# EAGLE design mcuBoard (EAGLE 7.4.0)
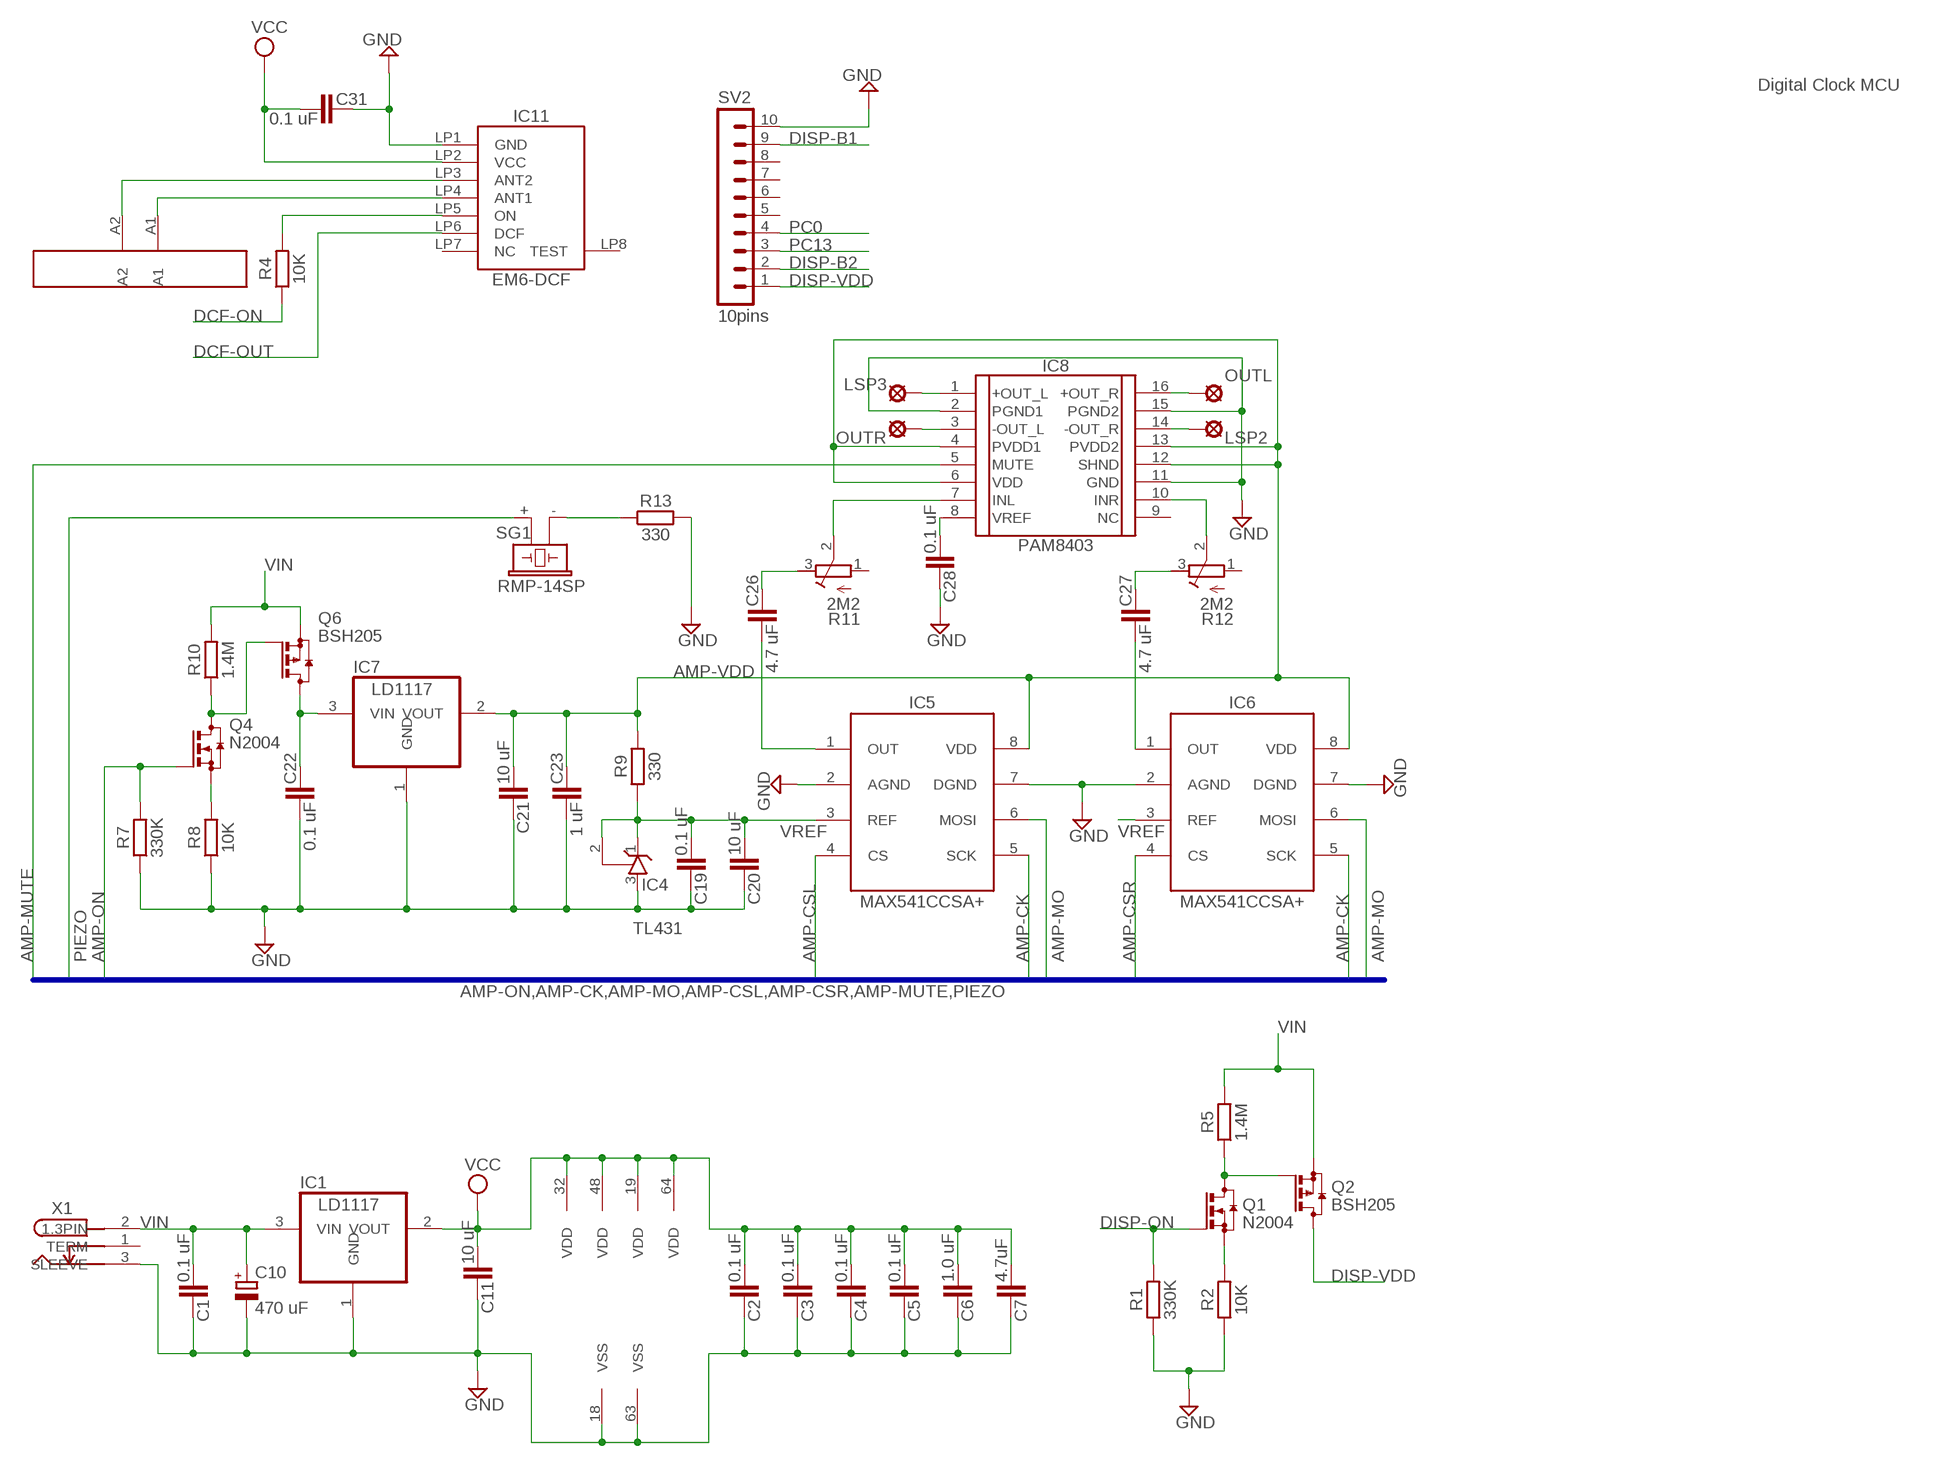
[diagram p0: schematic, sheet 1, part 1 of 2]
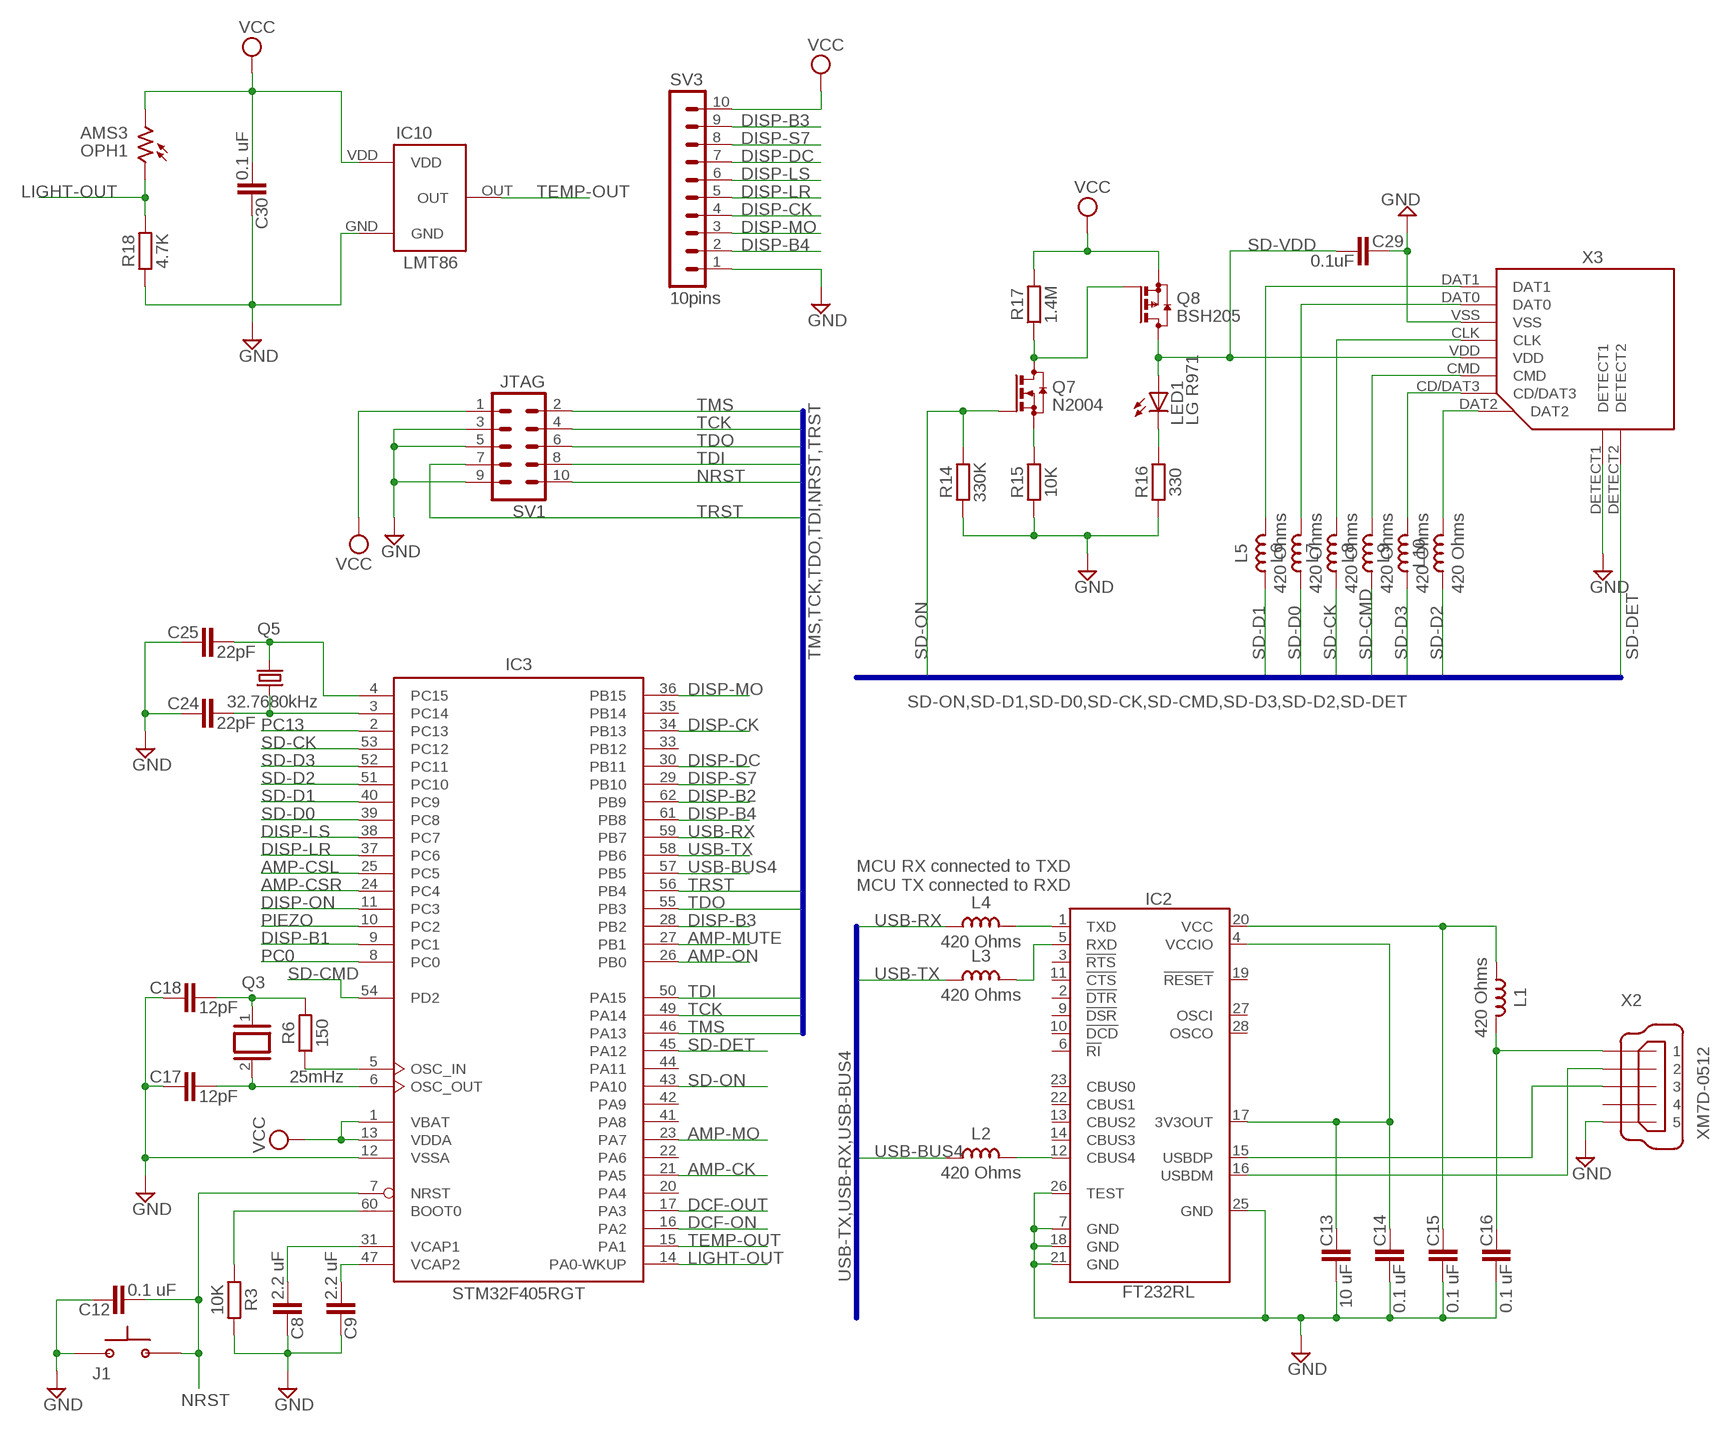
[diagram p1: schematic, sheet 1, part 2 of 2]

## Parts
A1  DCF77-ANT  [DCF77-ANT]
C1  0.1 uF  C-EUC1206  [C1206]
C2  0.1 uF  C-EUC1206  [C1206]
C3  0.1 uF  C-EUC1206  [C1206]
C4  0.1 uF  C-EUC1206  [C1206]
C5  0.1 uF  C-EUC1206  [C1206]
C6  1.0 uF  C-EUC1206  [C1206]
C7  4.7uF  C-EUC1206  [C1206]
C8  2.2 uF  C-EUC1206  [C1206]
C9  2.2 uF  C-EUC1206  [C1206]
C10  470 uF  CPOL-EUTT5D11L  [TT5D11L]
C11  10 uF  C-EUC1206  [C1206]
C12  0.1 uF  C-EUC1206  [C1206]
C13  10 uF  C-EUC1206  [C1206]
C14  0.1 uF  C-EUC1206  [C1206]
C15  0.1 uF  C-EUC1206  [C1206]
C16  0.1 uF  C-EUC1206  [C1206]
C17  12pF  C-EUC1206  [C1206]
C18  12pF  C-EUC1206  [C1206]
C19  0.1 uF  C-EUC1206  [C1206]
C20  10 uF  C-EUC1206  [C1206]
C21  10 uF  C-EUC1206  [C1206]
C22  0.1 uF  C-EUC1206  [C1206]
C23  1 uF  C-EUC1206  [C1206]
C24  22pF  C-EUC1206  [C1206]
C25  22pF  C-EUC1206  [C1206]
C26  4.7 uF  C-EUC1206  [C1206]
C27  4.7 uF  C-EUC1206  [C1206]
C28  0.1 uF  C-EUC1206  [C1206]
C29  0.1uF  C-EUC1206  [C1206]
C30  0.1 uF  C-EUC1206  [C1206]
C31  0.1 uF  C-EUC1206  [C1206]
IC1  LD1117  REG1117  [SOT223]
IC2  FT232RL  [SSOP28]
IC3  STM32F405RGT  [LQFP64]
IC4  TL431  TL431CL3T  [SOT-23]
IC5  MAX541CCSA+  MAX541  [SOIC-8]
IC6  MAX541CCSA+  MAX541  [SOIC-8]
IC7  LD1117  REG1117  [SOT223]
IC8  PAM8403  [SOP-16]
IC10  LMT86  [LMT86]
IC11  DCF77  [DCF77]
J1  BUTTON-FSM14JRT  [BUTTON-FSM14JRT]
L1  420 Ohms  L0603  [L0603]
L2  420 Ohms  L0603  [L0603]
L3  420 Ohms  L0603  [L0603]
L4  420 Ohms  L0603  [L0603]
L5  420 Ohms  L0603  [L0603]
L6  420 Ohms  L0603  [L0603]
L7  420 Ohms  L0603  [L0603]
L8  420 Ohms  L0603  [L0603]
L9  420 Ohms  L0603  [L0603]
L10  420 Ohms  L0603  [L0603]
LED1  LG R971  LEDCHIP-LED0805  [CHIP-LED0805]
LSP2  LSP10  [LSP10]
LSP3  LSP10  [LSP10]
OPH1  AMS3  VT935GB  [VT900]
OUTL  LSP10  [LSP10]
OUTR  LSP10  [LSP10]
Q1  N2004  BSS123  [SOT23]
Q2  BSH205  BSS84  [SOT23]
Q3  25mHz  HC-46X  [HC-46X]
Q4  N2004  BSS123  [SOT23]
Q5  32.7680kHz  MC-306  [MC-306]
Q6  BSH205  BSS84  [SOT23]
Q7  N2004  BSS123  [SOT23]
Q8  BSH205  BSS84  [SOT23]
R1  330K  R-EU_R1206  [R1206]
R2  10K  R-EU_R1206  [R1206]
R3  10K  R-EU_R1206  [R1206]
R4  10K  R-EU_R1206  [R1206]
R5  1.4M  R-EU_R1206  [R1206]
R6  150  R-EU_R1206  [R1206]
R7  330K  R-EU_R1206  [R1206]
R8  10K  R-EU_R1206  [R1206]
R9  330  R-EU_R1206  [R1206]
R10  1.4M  R-EU_R1206  [R1206]
R11  2M2  R-TRIM3362U  [R-TRIM-3362U]
R12  2M2  R-TRIM3362U  [R-TRIM-3362U]
R13  330  R-EU_R1206  [R1206]
R14  330K  R-EU_R1206  [R1206]
R15  10K  R-EU_R1206  [R1206]
R16  330  R-EU_R1206  [R1206]
R17  1.4M  R-EU_R1206  [R1206]
R18  4.7K  R-EU_R1206  [R1206]
SG1  RMP-14SP  F/CM12P  [F/CM12P]
SV1  JTAG  MA05-2  [MA05-2]
SV2  10pins  MA10-1  [MA10-1]
SV3  10pins  MA10-1  [MA10-1]
X1  DC-8N  [BUCHSE-1.3X3.75]
X2  XM7D-0512  MINI-USB-5-DPI32005-601  [XM7D-0512]
X3  MICRO-SD-DM3AT  [DM3AT]

## Nets
AMP-CK: IC3.21(PA5) IC5.5(SCK) IC6.5(SCK)
AMP-CSL: IC3.25(PC5) IC5.4(CS)
AMP-CSR: IC3.24(PC4) IC6.4(CS)
AMP-MO: IC3.23(PA7) IC5.6(MOSI) IC6.6(MOSI)
AMP-MUTE: IC3.27(PB1) IC8.5(MUTE)
AMP-ON: IC3.26(PB0) Q4.1(G) R7.2
AMP-VDD: C21.2 C23.1 IC5.8(VDD) IC6.8(VDD) IC7.2(VOUT) IC8.4(PVDD1) IC8.6(VDD) IC8.12(SHND) IC8.13(PVDD2) R9.2
BOOT: IC3.60(BOOT0) R3.1
D_VG: Q7.3(D) Q8.1(G) R17.1
D_VG1: Q4.3(D) Q6.1(G) R10.1
D_VG2: Q1.3(D) Q2.1(G) R5.1
DAC_OUTR: C27.2 IC6.1(OUT)
DCF-ON: IC3.16(PA2) R4.1
DCF-OUT: IC3.17(PA3) IC11.LP6(DCF)
DISP-B1: IC3.9(PC1) SV2.9
DISP-B2: IC3.62(PB9) SV2.2
DISP-B3: IC3.28(PB2) SV3.9
DISP-B4: IC3.61(PB8) SV3.2
DISP-CK: IC3.34(PB13) SV3.4
DISP-DC: IC3.30(PB11) SV3.7
DISP-LR: IC3.37(PC6) SV3.5
DISP-LS: IC3.38(PC7) SV3.6
DISP-MO: IC3.36(PB15) SV3.3
DISP-ON: IC3.11(PC3) Q1.1(G) R1.2
DISP-S7: IC3.29(PB10) SV3.8
DISP-VDD: Q2.3(D) SV2.1
GND: C1.1 C2.1 C3.1 C4.1 C5.1 C6.1 C7.1 C8.1 C9.1 C10.- C11.1 C12.1 C13.2 C14.2 C15.2 C16.2 C17.1 C18.1 C19.1 C20.1 C21.1 C22.2 C23.2 C24.1 C25.1 C28.1 C29.1 C30.1 C31.1 IC1.1(GND) IC2.7(GND) IC2.18(GND) IC2.21(GND) IC2.25(GND) IC2.26(TEST) IC3.12(VSSA) IC3.18(VSS) IC3.63(VSS) IC4.3(A) IC5.2(AGND) IC5.7(DGND) IC6.2(AGND) IC6.7(DGND) IC7.1(GND) IC8.2(PGND1) IC8.11(GND) IC8.15(PGND2) IC10.GND IC11.LP1(GND) J1.P$1 R1.1 R2.1 R3.2 R7.1 R8.1 R13.2 R14.1 R15.1 R16.1 R18.1 SV1.3 SV1.5 SV1.9 SV2.10 SV3.1 X1.3(SLEEVE) X2.5 X3.DETECT1 X3.VSS
LIGHT-OUT: IC3.14(PA0-WKUP) OPH1.1 R18.2
N$4: IC3.5(OSC_IN) R6.1
N$5: A1.A1 IC11.LP4(ANT1)
N$6: A1.A2 IC11.LP3(ANT2)
N$10: L10.2 X3.DAT2
N$11: L9.2 X3.CD/DAT3
N$13: L8.2 X3.CMD
N$17: L7.2 X3.CLK
N$22: L6.2 X3.DAT0
N$24: L5.2 X3.DAT1
N$26: Q4.2(S) R8.2
N$27: C26.2 IC5.1(OUT)
N$29: IC8.16(+OUT_R) OUTL.MP
N$36: C26.1 R11.3
N$37: C28.2 IC8.8(VREF)
N$38: C27.1 R12.3
N$39: R13.1 SG1.-
N$40: C22.1 IC7.3(VIN) Q6.3(D)
N$43: C16.1 L1.2 X2.1
N$46: C15.1 IC2.20(VCC) L1.1
N$47: C13.1 C14.1 IC2.4(VCCIO) IC2.17(3V3OUT)
N$48: IC2.16(USBDM) X2.2
N$52: IC2.15(USBDP) X2.3
N$53: IC2.1(TXD) L4.2
N$54: IC2.5(RXD) L3.2
N$63: IC2.12(CBUS4) L2.1
N$66: Q1.2(S) R2.2
N$71: C18.2 Q3.1 R6.2
N$78: C17.2 IC3.6(OSC_OUT) Q3.2
N$97: IC11.LP5(ON) R4.2
N$120: LED1.C R16.2
N$136: Q7.2(S) R15.2
N$163: IC8.1(+OUT_L) LSP3.MP
N$165: IC8.3(-OUT_L) OUTR.MP
N$172: IC8.14(-OUT_R) LSP2.MP
N$178: IC8.7(INL) R11.2
N$180: IC8.10(INR) R12.2
NRST: C12.2 IC3.7(NRST) J1.P$2 SV1.10
PC0: IC3.8(PC0) SV2.4
PC13: IC3.2(PC13) SV2.3
PIEZO: IC3.10(PC2) SG1.+
Q2M: C24.2 IC3.3(PC14) Q5.1
Q2P: C25.2 IC3.4(PC15) Q5.4
SD-CK: IC3.53(PC12) L7.1
SD-CMD: IC3.54(PD2) L8.1
SD-D0: IC3.39(PC8) L6.1
SD-D1: IC3.40(PC9) L5.1
SD-D2: IC3.51(PC10) L10.1
SD-D3: IC3.52(PC11) L9.1
SD-DET: IC3.45(PA12) X3.DETECT2
SD-ON: IC3.43(PA10) Q7.1(G) R14.2
SD-VDD: C29.2 LED1.A Q8.3(D) X3.VDD
TCK: IC3.49(PA14) SV1.4
TDI: IC3.50(PA15) SV1.8
TDO: IC3.55(PB3) SV1.6
TEMP-OUT: IC3.15(PA1) IC10.OUT
TMS: IC3.46(PA13) SV1.2
TRST: IC3.56(PB4) SV1.7
USB-BUS4: IC3.57(PB5) L2.2
USB-RX: IC3.59(PB7) L4.1
USB-TX: IC3.58(PB6) L3.1
VCAP1: C8.2 IC3.31(VCAP1)
VCAP2: C9.2 IC3.47(VCAP2)
VCC: C2.2 C3.2 C4.2 C5.2 C6.2 C7.2 C11.2 C30.2 C31.2 IC1.2(VOUT) IC3.1(VBAT) IC3.13(VDDA) IC3.19(VDD) IC3.32(VDD) IC3.48(VDD) IC3.64(VDD) IC10.VDD IC11.LP2(VCC) OPH1.2 Q8.2(S) R17.2 SV1.1 SV3.10
VIN: C1.2 C10.+ IC1.3(VIN) Q2.2(S) Q6.2(S) R5.2 R10.2 X1.2(1.3PIN)
VREF: C19.2 C20.2 IC4.1(C) IC4.2(R) IC5.3(REF) IC6.3(REF) R9.1
Unconnected: IC2.2(!DTR) IC2.3(!RTS) IC2.6(!RI) IC2.9(!DSR) IC2.10(!DCD) IC2.11(!CTS) IC2.13(CBUS2) IC2.14(CBUS3) IC2.19(!RESET) IC2.22(CBUS1) IC2.23(CBUS0) IC2.27(OSCI) IC2.28(OSCO) IC3.20(PA4) IC3.22(PA6) IC3.33(PB12) IC3.35(PB14) IC3.41(PA8) IC3.42(PA9) IC3.44(PA11) IC8.9(NC) IC11.LP7(NC) IC11.LP8(TEST) R11.1 R12.1 SV2.5 SV2.6 SV2.7 SV2.8 X1.1(TERM) X2.4 X2.M1(S1) X2.M2(S2) X2.M3(S3) X2.M4(S4)

## Buses
TMS,TCK,TDO,TDI,NRST,TRST
SD-ON,SD-D1,SD-D0,SD-CK,SD-CMD,SD-D3,SD-D2,SD-DET
AMP-ON,AMP-CK,AMP-MO,AMP-CSL,AMP-CSR,AMP-MUTE,PIEZO
USB-TX,USB-RX,USB-BUS4

## Notes on the sheet
- Digital Clock MCU
- MCU RX connected to TXD
  MCU TX connected to RXD

## Library data of the parts
A1 = MyComponents:DCF77-ANT
C1-C9 C11-C31 = rcl:C-EU: CAPACITOR, European symbol
C10 = rcl:CPOL-EU: POLARIZED CAPACITOR, European symbol
IC1 IC7 = burr-brown:REG1117: 800mA and 1A Low Dropout (LDO) Positive Regulator 1.8V, 2.5V, 2.85V, 3.3V, 5V, and Adj; MPN: REG1117; OC_FARNELL: 1097566; OC_NEWARK: 14P6981
IC2 = ftdichip:FT232R: Source: http://www.ftdichip.com/Documents/DataSheets/DS_FT232R_v104.pdf; MPN: FT232RL; OC_FARNELL: 1146032; OC_NEWARK: 91K9918
IC3 = stm32:STM32F405R*T: ARM 32-bit Cortex™-M3 CPU 168 MHz maximum frequency 1024 Kbytes of Flash memory 192 kbytes of SRAM 51 GPIOs 1.8 to 3.6 V application supply
IC4 = MyComponents:TL431CL3T
IC5 IC6 = MyComponents:MAX541: 16-Bit DACs
IC8 = MyComponents:PAM8403: Class-D stereo audio power amplifier (3W)
IC10 = MyComponents:LMT86: Analog Temperature Sensors withClass-AB Output
IC11 = MyComponents:DCF77: EM6 DCF-Empfangsmodul
J1 = MyComponents:BUTTON-FSM14JRT: Drucktastenschalter RADIAL TACT SWITCH TE Connectivity / Alcoswitch 1571010-1
L1-L10 = MyComponents:L0603
LED1 = led:LED: LED OSRAM: - CHIPLED LG R971, LG N971, LY N971, LG Q971, LY Q971, LO R971, LY R971 LH N974, LH R974 LS Q976, LO Q976, LY Q976 LO Q996 - Hyper CHIPLED LW Q18S LB Q993, LB Q99A, LB R99A - SideLED LS A670, LO A670, LY A670, LG A670, LP A670 LB A673, LV A673, LT A673, LW A673 LH A674 LY A675 LS A676, LA A676, LO A676, LY A676, LW A676 LS A679, LY A679, LG A679 - Hyper Micro SIDELED® LS Y876, LA Y876, LO Y876, LY Y876 LT Y87S - SmartLED LW L88C, LW L88S LB L89C, LB L89S, LG L890 LS L89K, LO L89K, LY L89K LS L896, LA L896, LO L896, LY L896 - TOPLED LS T670, LO T670, LY T670, LG T670, LP T670 LSG T670, LSP T670, LSY T670, LOP T670, LYG T670 LG T671, LOG T671, LSG T671 LB T673, LV T673, LT T673, LW T673 LH T674 LS T676, LA T676, LO T676, LY T676, LB T676, LH T676, LSB T676, LW T676 LB T67C, LV T67C, LT T67C, LS T67K, LO T67K, LY T67K, LW E67C LS E67B, LA E67B, LO E67B, LY E67B, LB E67C, LV E67C, LT E67C LW T67C LS T679, LY T679, LG T679 LS T770, LO T770, LY T770, LG T770, LP T770 LB T773, LV T773, LT T773, LW T773 LH T774 LS E675, LA E675, LY E675, LS T675 LS T776, LA T776, LO T776, LY T776, LB T776 LHGB T686 LT T68C, LB T68C - Hyper Mini TOPLED® LB M676 - Mini TOPLED Santana® LG M470 LS M47K, LO M47K, LY M47K Source: http://www.osram.convergy.de LUXEON: - LUMILED® LXK2-PW12-R00, LXK2-PW12-S00, LXK2-PW14-U00, LXK2-PW14-V00 LXK2-PM12-R00, LXK2-PM12-S00, LXK2-PM14-U00 LXK2-PE12-Q00, LXK2-PE12-R00, LXK2-PE12-S00, LXK2-PE14-T00, LXK2-PE14-U00 LXK2-PB12-K00, LXK2-PB12-L00, LXK2-PB12-M00, LXK2-PB14-N00, LXK2-PB14-P00, LXK2-PB14-Q00 LXK2-PR12-L00, LXK2-PR12-M00, LXK2-PR14-Q00, LXK2-PR14-R00 LXK2-PD12-Q00, LXK2-PD12-R00, LXK2-PD12-S00 LXK2-PH12-R00, LXK2-PH12-S00 LXK2-PL12-P00, LXK2-PL12-Q00, LXK2-PL12-R00 Source: www.luxeon.com KINGBRIGHT: KA-3528ASYC Source: www.kingbright.com
LSP2 LSP3 OUTL OUTR = MyComponents:LSP10: SOLDER PAD drill 1.0 mm, distributor Buerklin, 12H555
OPH1 = photo-elements:VT9: Photoconductive Cell VT900 Series Source: http://optoelectronics.perkinelmer.com/content/Datasheets/DTS_vt900seriesdatasheet.pdf
Q1 Q4 Q7 = transistor-small-signal:BSS123: N-CHANNEL MOS FET
Q2 Q6 Q8 = transistor-small-signal:BSS84: P-CHANNEL MOS FET
Q3 = MyComponents:HC-46X: Quartz Crystal HC-46X
Q5 = crystal:MC-306: kHz RANGE CRYSTAL UNIT SMD Source: MC-306_405_406_E07X.PDF Homepage <http://www.epsontoyocom.co.jp>; MPN: MC-306 60.0KHZ 100PPM ,12.5PF; OC_FARNELL: 1278040; OC_NEWARK: 31M5576
R1-R10 R13-R18 = rcl:R-EU_: RESISTOR, European symbol
R11 R12 = MyComponents:R-TRIM: Trimmer Potentiometers
SG1 = buzzer:F/CM12P: BUZZER Source: Buerklin; OC_FARNELL: unknown; OC_NEWARK: unknown
SV1 = con-lstb:MA05-2: PIN HEADER; OC_FARNELL: unknown; OC_NEWARK: unknown
SV2 SV3 = con-lstb:MA10-1: PIN HEADER; OC_FARNELL: unknown; OC_NEWARK: unknown
X1 = MyComponents:DC-8N: Niedervolt-Steckverbinder Buchse, Einbau horizontal 3.75 mm 1.3 mm Cliff DC-8N
X2 = MyComponents:MINI-USB-5-DPI: OMRON Mini-USB Connector XM7; OC_FARNELL: unknown; OC_NEWARK: unknown
X3 = MyComponents:MICRO-SD-DM3AT: DM3 Series microSDTM Card Connectors

## Board
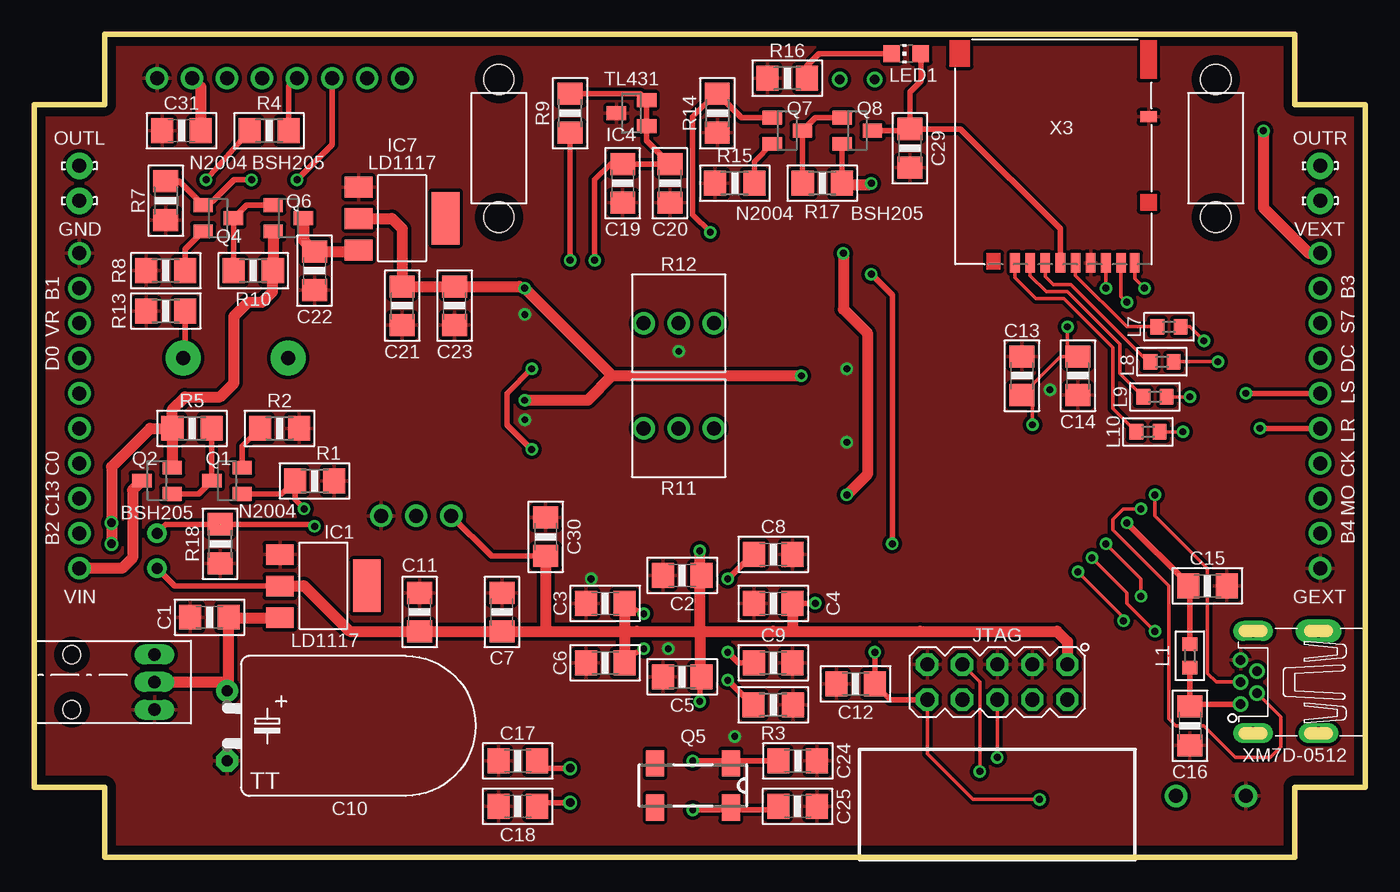
[diagram p2: board, top side]
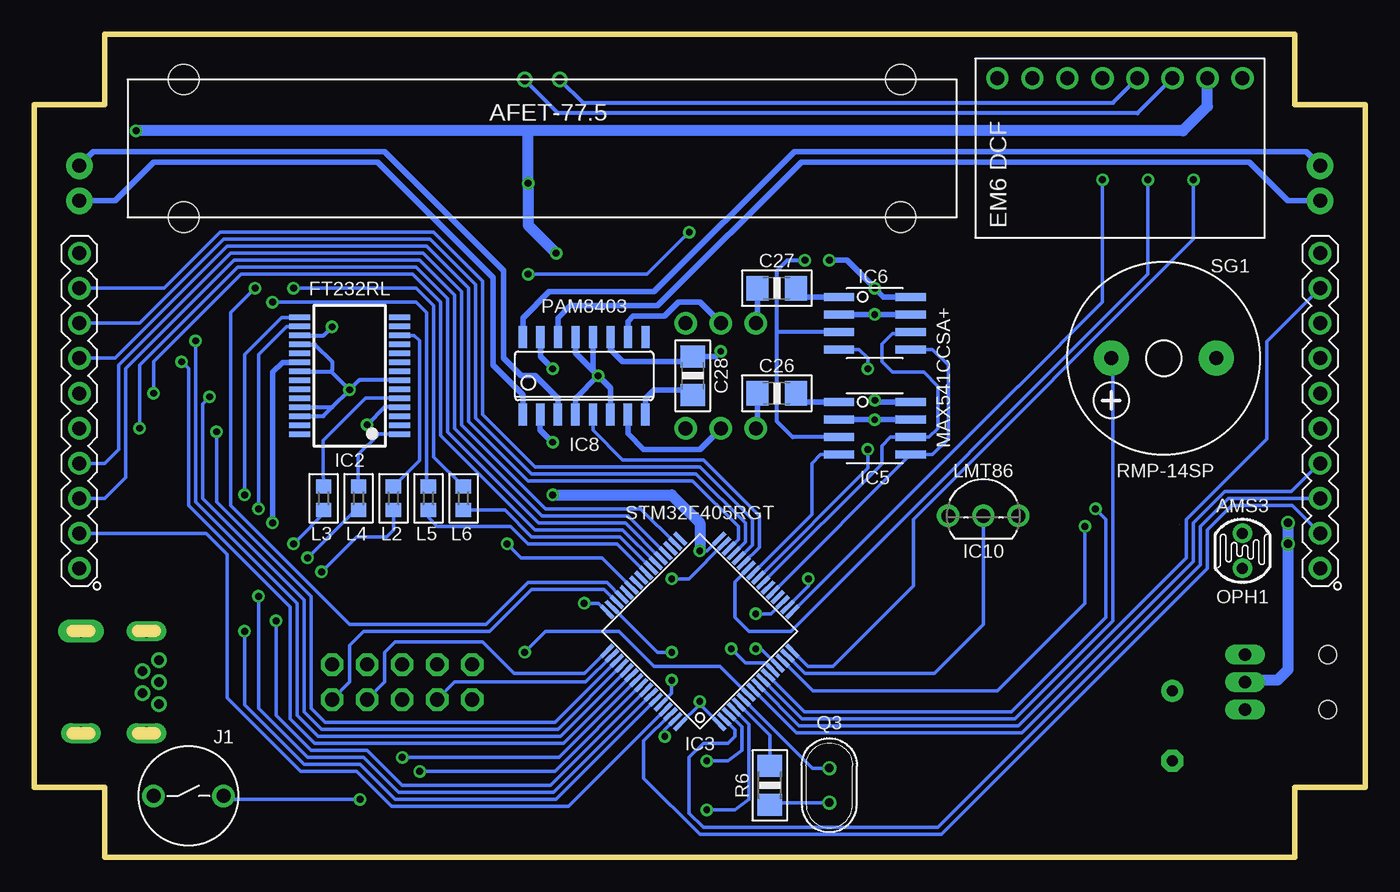
[diagram p3: board, bottom side, seen from below]

Size 96.52 x 59.69 mm. Coordinates in mm from the lower left corner, seen from the top.
Outline: 0,5.08 0,54.61 5.08,54.61 5.08,59.69 91.44,59.69 91.44,54.61 96.52,54.61 96.52,5.08 91.44,5.08 91.44,0 5.08,0 5.08,5.08 0,5.08
Copper layers (1*16): Top 0.035mm / dielectric 1.5mm / Bottom 0.035mm
Design rules "default *": minimum track width 0.000253125mm, minimum drill 0.00048125mm, track to track 10mil, track to pad 12mil, pad to pad 12mil, via to via 12mil, smd to smd 4mil, copper to edge 25mil, drill to drill 40mil, minimum pad ring 8mil, minimum via ring 8mil, stop-mask expansion 4mil, vias tented up to drill 0mil, thermal gap 10mil

### Footprints (pad centres in the part's own frame; a part is rotated, then mirrored left to right if it is on the bottom)
DCF77-ANT = drill 0.7: A1 1.27,4.978; A2 -1.27,4.978 | hole 2.2: -26,5; -26,-5; 26,-5; 26,5
C1206 = smd 1.6 x 1.8: 1 -1.4,0; 2 1.4,0
TT5D11L = drill 0.813 pad 1.6: + -2.54,0 | drill 0.813 pad 1.6 octagon: - 2.54,0
SOT223 = smd 1.499 x 2.007: 1 -2.261,-3.15; 2 0.025,-3.15; 3 2.311,-3.15 | smd 3.81 x 2.007: 4 0,3.15
SSOP28 = smd 0.4 x 1.5: 1 -4.225,-3.625; 2 -3.575,-3.625; 3 -2.925,-3.625; 4 -2.275,-3.625; 5 -1.625,-3.625; 6 -0.975,-3.625; 7 -0.325,-3.625; 8 0.325,-3.625; 9 0.975,-3.625; 10 1.625,-3.625; 11 2.275,-3.625; 12 2.925,-3.625; 13 3.575,-3.625; 14 4.225,-3.625; 15 4.225,3.625; 16 3.575,3.625; 17 2.925,3.625; 18 2.275,3.625; 19 1.625,3.625; 20 0.975,3.625; 21 0.325,3.625; 22 -0.325,3.625; 23 -0.975,3.625; 24 -1.625,3.625; 25 -2.275,3.625; 26 -2.925,3.625; 27 -3.575,3.625; 28 -4.225,3.625
LQFP64 = smd 0.3 x 1.2: 1 -3.75,-5.75; 2 -3.25,-5.75; 3 -2.75,-5.75; 4 -2.25,-5.75; 5 -1.75,-5.75; 6 -1.25,-5.75; 7 -0.75,-5.75; 8 -0.25,-5.75; 9 0.25,-5.75; 10 0.75,-5.75; 11 1.25,-5.75; 12 1.75,-5.75; 13 2.25,-5.75; 14 2.75,-5.75; 15 3.25,-5.75; 16 3.75,-5.75; 33 3.75,5.75; 34 3.25,5.75; 35 2.75,5.75; 36 2.25,5.75; 37 1.75,5.75; 38 1.25,5.75; 39 0.75,5.75; 40 0.25,5.75; 41 -0.25,5.75; 42 -0.75,5.75; 43 -1.25,5.75; 44 -1.75,5.75; 45 -2.25,5.75; 46 -2.75,5.75; 47 -3.25,5.75; 48 -3.75,5.75 | smd 1.2 x 0.3: 17 5.75,-3.75; 18 5.75,-3.25; 19 5.75,-2.75; 20 5.75,-2.25; 21 5.75,-1.75; 22 5.75,-1.25; 23 5.75,-0.75; 24 5.75,-0.25; 25 5.75,0.25; 26 5.75,0.75; 27 5.75,1.25; 28 5.75,1.75; 29 5.75,2.25; 30 5.75,2.75; 31 5.75,3.25; 32 5.75,3.75; 49 -5.75,3.75; 50 -5.75,3.25; 51 -5.75,2.75; 52 -5.75,2.25; 53 -5.75,1.75; 54 -5.75,1.25; 55 -5.75,0.75; 56 -5.75,0.25; 57 -5.75,-0.25; 58 -5.75,-0.75; 59 -5.75,-1.25; 60 -5.75,-1.75; 61 -5.75,-2.25; 62 -5.75,-2.75; 63 -5.75,-3.25; 64 -5.75,-3.75
SOT-23 = smd 1 x 1.4: 1 -0.95,-1.1; 2 0.95,-1.1; 3 0,1.1
SOIC-8 = smd 0.6 x 2.2: 1 -1.905,-2.6; 2 -0.635,-2.6; 3 0.635,-2.6; 4 1.905,-2.6; 5 1.905,2.6; 6 0.635,2.6; 7 -0.635,2.6; 8 -1.905,2.6
SOP-16 = smd 0.6 x 1.6: 1 -4.445,-2.8; 2 -3.185,-2.8; 3 -1.915,-2.8; 4 -0.645,-2.8; 5 0.635,-2.8; 6 1.895,-2.8; 7 3.165,-2.8; 8 4.435,-2.8; 9 4.445,2.8; 10 3.175,2.8; 11 1.905,2.8; 12 0.635,2.8; 13 -0.635,2.8; 14 -1.905,2.8; 15 -3.175,2.8; 16 -4.445,2.8
LMT86 = drill 1.016: GND 2.54,0; OUT 0,0; VDD -2.54,0
DCF77 = drill 1.016: LP1 5.08,-8.89; LP2 5.08,-6.35; LP3 5.08,-3.81; LP4 5.08,-1.27; LP5 5.08,1.27; LP6 5.08,3.81; LP7 5.08,6.35; LP8 5.08,8.89
BUTTON-FSM14JRT = drill 1.016: P$1 -2.54,0; P$2 2.54,0
L0603 = smd 1 x 1.1: 1 -0.85,0; 2 0.85,0
CHIP-LED0805 = smd 1.2 x 1.2: A 0,-1.05; C 0,1.05
LSP10 = drill 1.016 pad 1.93: MP 0,0
VT900 = drill 0.8 pad 1.4: 1 -1.27,0; 2 1.27,0
SOT23 = smd 1 x 1.4: 1 -0.95,-1.1; 2 0.95,-1.1; 3 0,1.1
HC-46X = drill 0.61: 1 -1.25,0; 2 1.25,0
MC-306 = smd 1.3 x 1.9: 1 -2.75,-1.6; 2 2.75,-1.6; 3 2.75,1.6; 4 -2.75,1.6
R1206 = smd 1.6 x 1.803: 1 -1.422,0; 2 1.422,0
R-TRIM-3362U = drill 1.016: 1 2.54,0; 2 0,0; 3 -2.54,0
F/CM12P = drill 1.016 pad 2.54: + 3.81,0; - -3.81,0
MA05-2 = drill 1.016 octagon: 1 -5.08,-1.27; 2 -5.08,1.27; 3 -2.54,-1.27; 4 -2.54,1.27; 5 0,-1.27; 6 0,1.27; 7 2.54,-1.27; 8 2.54,1.27; 9 5.08,-1.27; 10 5.08,1.27
MA10-1 = drill 1.016: 1 -11.43,0; 2 -8.89,0; 3 -6.35,0; 4 -3.81,0; 5 -1.27,0; 6 1.27,0; 7 3.81,0; 8 6.35,0; 9 8.89,0; 10 11.43,0
BUCHSE-1.3X3.75 = drill 0.9 long: 1 -3,-2; 2 -3,0; 3 -3,2 | hole 1.3: 3,2; 3,-2
XM7D-0512 = drill 0.7 pad 1.016: 1 1.6,-0.9; 2 0.8,0.3; 3 0,-0.9; 4 -0.8,0.3; 5 -1.6,-0.9 | drill 0.9 pad 1.422 long: M1 3.7,4.75; M3 -3.7,0; M4 3.7,0 | drill 0.9 pad 1.676 long: M2 -3.7,4.75
DM3AT = smd 0.7 x 1.4: CD/DAT3 -1.1,0.7; CLK -4.4,0.7; CMD -2.2,0.7; DAT0 -6.6,0.7; DAT1 -7.7,0.7; DAT2 0,0.7; DETECT2 -8.69,0.7; VDD -3.3,0.7; VSS -5.5,0.7 | smd 1.2 x 0.8: DETECT1 -9.7,-9.9

### Placement (x,y rotation side)
A1  59.69,51.44 0 bottom
C1  12.7,17.41 0 top
C2  46.99,20.45 0 top
C3  41.4,18.41 0 top
C4  53.59,18.41 0 top
C5  46.99,13.08 0 top
C6  41.4,14.1 0 top
C7  33.91,17.78 270 top
C8  53.59,21.97 180 top
C9  53.59,14.1 180 top
C10  13.97,9.53 270 top
C11  27.94,17.78 270 top
C12  59.56,12.57 0 top
C13  71.63,34.93 90 top
C14  75.69,34.93 270 top
C15  85.09,19.68 0 top
C16  83.82,9.53 270 top
C17  35.05,6.99 0 top
C18  35.05,3.68 0 top
C19  42.67,48.9 90 top
C20  46.1,48.9 90 top
C21  26.67,40.01 90 top
C22  20.32,42.55 270 top
C23  30.48,40.01 270 top
C24  55.37,6.98 180 top
C25  55.36,3.69 180 top
C26  42.67,33.66 0 bottom
C27  42.67,41.27 0 bottom
C28  48.77,34.93 270 bottom
C29  63.5,51.44 90 top
C30  37.08,23.24 270 top
C31  10.67,52.71 0 top
IC1  20.95,19.68 270 top
IC2  73.66,34.93 90 bottom
IC3  48.26,16.38 45 bottom
IC4  43.31,53.98 90 top
IC5  35.56,31.11 270 bottom
IC6  35.56,38.73 270 bottom
IC7  26.67,46.36 270 top
IC8  56.64,34.93 0 bottom
IC10  27.69,24.76 0 bottom
IC11  17.78,51.44 90 bottom
J1  85.34,4.45 0 bottom
L1  83.82,14.61 270 top
L2  70.48,26.04 270 bottom
L3  75.55,26.04 90 bottom
L4  73.01,26.04 90 bottom
L5  67.94,26.04 90 bottom
L6  65.41,26.04 90 bottom
L7  82.3,38.48 180 top
L8  81.79,35.94 180 top
L9  81.28,33.4 180 top
L10  80.77,30.86 180 top
LED1  63.25,58.29 90 top
LSP2  3.25,47.62 0 top
LSP3  93.26,47.62 0 top
OPH1  8.89,22.22 270 bottom
OUTL  3.25,50.16 0 top
OUTR  93.26,50.16 0 top
Q1  13.97,27.3 90 top
Q2  8.89,27.3 90 top
Q3  38.86,5.21 90 bottom
Q4  13.34,46.36 270 top
Q5  47.76,5.2 180 top
Q6  18.41,46.36 270 top
Q7  54.61,52.71 270 top
Q8  59.69,52.71 270 top
R1  20.32,27.3 180 top
R2  17.78,31.11 180 top
R3  53.59,11.05 0 top
R4  17.02,52.71 0 top
R5  11.43,31.11 180 top
R6  43.18,5.21 270 bottom
R7  9.53,47.62 90 top
R8  9.53,42.55 0 top
R9  38.86,53.98 270 top
R10  15.88,42.55 0 top
R11  46.74,31.11 0 top
R12  46.74,38.73 0 top
R13  9.53,39.62 180 top
R14  49.53,53.98 90 top
R15  50.8,48.9 0 top
R16  54.61,56.52 0 top
R17  57.15,48.9 0 top
R18  13.46,22.73 90 top
SG1  14.61,36.2 180 bottom
SV1  69.85,12.7 180 top
SV2  3.26,32.39 90 bottom
SV3  93.26,32.39 90 bottom
X1  5.71,12.7 180 top
X2  88.39,12.7 270 top
X3  71.12,43.82 180 top

### Tracks (layer width: path | path; a pad name or v marks a point on that pad's centre or on a via)
AMP-CK
  Bottom 0.254: IC3.21 IC5.5 31.37,29.21 30.23,30.35 30.23,35.69 31.37,36.83 IC6.5
AMP-CSL
  Bottom 0.254: IC3.25 40.13,24.86 40.13,28.57 39.5,29.21 IC5.4
AMP-CSR  (via drill 0.5)
  Top 0.406: v36.07,35.43 34.29,33.66 34.29,31.37 v36.07,29.59
  Bottom 0.254: v36.07,29.59 36.07,28.22 IC3.24 | IC6.4 36.7,36.83 36.07,36.2 v36.07,35.43
AMP-MO
  Bottom 0.254: IC3.23 35.05,28.53 35.05,29.84 34.42,30.48 IC5.6 31.62,30.48 30.99,31.11 30.99,34.16 32,35.18 34.29,35.18 35.05,35.94 35.05,37.21 34.29,37.97 33.09,37.97 IC6.6
AMP-MUTE
  Bottom 0.254: IC3.27 43.94,22.47 43.94,24.76 48.01,28.83 53.85,28.83 56.01,30.99 IC8.5
AMP-ON  (via drill 0.5)
  Top 0.254: 12.89,47.56 Q4.1
  Top 0.406: R7.2 10.49,49.05 Q4.1 | v15.75,49.15 14.48,49.15 12.89,47.56
  Bottom 0.254: IC3.26 45.72,19.98 45.72,17.4 44.7,16.38 41.66,16.38 15.75,42.29 v15.75,49.15
AMP-VDD  (via drill 0.5)
  Top 0.406: 41.91,34.93 42.93,34.93 | v38.86,43.31 R9.2
  Top 0.813: 41.91,34.93 v55.63,34.93 | 41.91,34.93 40.13,33.15 v35.56,33.15 | 41.91,34.93 v35.56,41.27 35.18,41.41 C23.1 C21.2 26.67,45.59 25.93,46.33 IC7.2
  Bottom 0.406: v55.63,34.93 54.75,34.05 IC8.6 | IC8.4 57.29,33.26 v55.63,34.93 | IC8.12 56.01,35.31 v55.63,34.93 | IC8.13 57.28,36.58 v55.63,34.93 | IC5.8 35.43,33.02 arc90 v35.56,33.15 | v38.86,43.31 37.59,43.31 v35.56,41.27 34.92,40.64 IC6.8
BOOT  (via drill 0.5)
  Top 0.406: v50.29,12.83 52.07,11.05 R3.1
  Bottom 0.254: IC3.60 50.29,11.88 v50.29,12.83
D_VG
  Top 0.406: R17.1 55.71,50.15 Q7.3 56.66,53.66 Q8.1
D_VG1
  Top 0.406: R10.1 14.44,42.56 Q4.3 15.38,47.3 Q6.1
D_VG2
  Top 0.406: R5.1 12.85,27.32 Q1.3 11.92,26.35 Q2.1
DAC_OUTR
  Bottom 0.406: IC6.1 41.27,40.64 arc90 41.4,40.77 41.4,41.15 arc90 C27.2
DCF-ON  (via drill 0.5)
  Top 0.406: v12.45,49.15 R4.1
  Bottom 0.254: IC3.16 40.42,13.84 38.61,13.84 32.77,19.68 32.77,24.51 12.45,44.83 v12.45,49.15
DCF-OUT  (via drill 0.5)
  Top 0.406: v19.05,49.15 21.59,51.69 IC11.LP6
  Bottom 0.254: IC3.17 25.18,34.16 25.15,34.16 19.05,40.26 v19.05,49.15
DISP-B1
  Bottom 0.254: IC3.9 41.05,9.53 25.15,9.53 12.95,21.72 12.95,24.51 7.11,30.35 7.11,37.42 SV2.9
DISP-B2
  Bottom 0.254: IC3.62 52.32,8.43 52.32,5.71 48.26,1.65 30.73,1.65 11.43,20.95 11.43,23.75 9.65,25.53 5.29,25.53 SV2.2
DISP-B3
  Bottom 0.254: IC3.28 44.45,22.67 44.45,24.51 48.26,28.32 60.2,28.32 64.01,32.13 64.01,41.78 67.56,45.34 83.06,45.34 87.12,41.27 SV3.9
DISP-B4
  Bottom 0.254: IC3.61 57.78,3.68 70.61,3.68 73.15,6.22 77.22,6.22 82.55,11.56 82.55,21.97 84.07,23.49 SV3.2
DISP-CK
  Bottom 0.254: IC3.34 52.55,25.27 59.44,25.27 65.53,31.37 65.53,41.02 68.33,43.82 82.3,43.82 90.42,35.69 90.42,29.59 91.44,28.57 SV3.4
DISP-DC
  Bottom 0.254: IC3.30 45.47,23.07 45.47,24 48.77,27.3 60.71,27.3 65.02,31.62 65.02,41.27 68.07,44.32 82.55,44.32 90.68,36.2 SV3.7
DISP-LR  (via drill 0.5 pad 0.5)
  Top 0.406: SV3.5 v88.9,31.11
  Bottom 0.254: IC3.37 53.66,24.26 59.94,24.26 66.55,30.86 66.55,40.51 68.83,42.8 81.79,42.8 88.9,35.69 v88.9,31.11
DISP-LS  (via drill 0.5 pad 0.5)
  Top 0.406: SV3.6 v87.88,33.66
  Bottom 0.254: IC3.38 53.86,23.75 60.2,23.75 67.06,30.61 67.06,40.26 69.09,42.29 81.53,42.29 87.88,35.94 v87.88,33.66
DISP-MO
  Bottom 0.254: IC3.36 53.46,24.76 59.69,24.76 66.04,31.11 66.04,40.77 68.58,43.31 82.04,43.31 89.92,35.43 89.92,27.56 91.44,26.04 SV3.3
DISP-ON  (via drill 0.5)
  Top 0.406: Q1.1 17.95,26.35 R1.2 18.9,25.93 v19.56,25.27
  Bottom 0.254: IC3.11 40.65,10.54 25.65,10.54 18.8,17.4 18.8,24.51 v19.56,25.27
DISP-S7
  Bottom 0.254: IC3.29 44.96,22.87 44.96,24.26 48.51,27.81 60.45,27.81 64.52,31.88 64.52,41.53 67.82,44.83 82.8,44.83 88.9,38.73 SV3.8
DISP-VDD
  Top 0.813: Q2.3 7.11,26.63 7.11,21.72 6.35,20.95 SV2.1
GND  (via drill 0.5)
  Bottom 0.254: IC3.63 50.8,9.25 v50.8,8.76 | IC3.18 40.39,19.66 v40.39,20.19 | IC3.12 43.5,14.1 44.96,14.1 v45.97,15.11
  Bottom 0.305: IC2.7 72.97,34.6 v73.66,33.91 | IC2.25 74.92,32.65 | 74.92,32.65 v73.66,33.91 | IC2.26 75.57,32 74.92,32.65 | IC2.21 75,35.25 | 75,35.25 v73.66,33.91 | IC2.18 76.19,37.2 74.93,35.94 74.93,35.32 75,35.25
  Bottom 0.406: IC6.7 v35.57,39.37 v35.57,39.38 38.15,39.38 IC6.2 | IC5.7 35.56,31.75 v35.57,31.74 38.15,31.74 IC5.2 | IC8.15 59.82,36.32 v58.93,35.43 | v46.74,36.7 47.11,36.33 C28.1 48.26,35.94 53.85,35.94 54.74,36.83 IC8.11 | IC8.2 59.83,31 v58.93,30.1
  pour Top: 0,54.61 5.08,54.61 5.08,59.69 91.44,59.69 91.44,54.61 96.52,54.61 96.52,5.08 91.44,5.08 91.44,0 5.08,0 5.08,5.08 0,5.08
LIGHT-OUT  (via drill 0.5)  (1 unrouted)
  Top 0.406: OPH1.1 9.53,24.13 13.46,24.13 20.19,24.13 v20.32,24
  Bottom 0.254: IC3.14 40.05,12.06 26.67,12.06 20.32,18.41 v20.32,24
N$4
  Bottom 0.254: IC3.5 43.18,8.83 R6.1
N$5
  Bottom 0.305: A1.A1 56.74,54.74 18.29,54.74 IC11.LP4
N$6
  Bottom 0.305: IC11.LP3 16.51,53.98 58.52,53.98 A1.A2
N$10
  Top 0.254: X3.DAT2 71.12,42.04 72.64,40.51 74.68,40.51 78.23,36.96 78.23,32.55 L10.2
N$11
  Top 0.254: X3.CD/DAT3 72.22,42.21 73.41,41.02 74.93,41.02 78.74,37.21 78.74,35.09 L9.2
N$13
  Top 0.254: X3.CMD 73.32,42.12 73.91,41.53 75.18,41.53 80.77,35.94 L8.2
N$17
  Top 0.254: X3.CLK 75.52,42.21 79.25,38.48 L7.2 arc-90 81.19,38.23
N$22  (via drill 0.5)
  Top 0.254: v77.72,41.27 X3.DAT0
  Bottom 0.254: v77.72,41.27 68.83,41.27 67.56,40.01 67.56,29.04 L6.2
N$24  (via drill 0.5)
  Top 0.254: X3.DAT1 78.82,40.69 v79.25,40.26
  Bottom 0.254: L5.2 67.94,26.54 68.07,27.3 68.07,39.5 68.83,40.26 v79.25,40.26
N$26
  Top 0.406: R8.2 10.95,44.12 Q4.2
N$27
  Bottom 0.406: IC5.1 41.15,33.02 C26.2
N$29
  Bottom 0.406: IC8.16 61.09,39.12 59.18,41.02 51.56,41.02 41.4,51.18 4.27,51.18 OUTL.MP
N$36
  Bottom 0.406: 44.2,33.66 C26.1 44.07,31.24 R11.3
N$37
  Bottom 0.406: C28.2 48.64,33.91 51.56,33.91 52.21,33.26 IC8.8
N$38
  Bottom 0.406: C27.1 44.07,38.86 R12.3
N$39
  Top 0.406: R13.1 10.95,36.35 SG1.-
N$40
  Top 0.813: Q6.3 19.52,44.75 C22.1 23.42,43.95 IC7.3
N$42  (via drill 0.5)
  other vias: 40.64,43.31
N$43
  Top 0.406: X2.1 83.82,11.1 C16.1 L1.2
N$46  (via drill 0.5)
  Top 0.305: C15.1 83.82,18.8
  Top 0.406: 83.82,18.8 L1.1 | C15.1 83.7,19.81 v79.25,24.26
  Bottom 0.406: v79.25,24.26 79.25,35.18 78.53,35.9 IC2.20
N$47  (via drill 0.5)
  Top 0.254: v72.39,31.37 72.39,32.76 | v74.93,38.48 74.93,37.09 | C14.1 74.43,36.33 C13.1
  Top 0.305: 72.39,32.76 C13.1 | 74.93,37.09 C14.1
  Bottom 0.305: IC2.4 71.11,32.65 v72.39,31.37 | IC2.17 75.56,37.85 v74.93,38.48
N$48  (via drill 0.5)
  Top 0.254: X2.2 90.42,10.17 90.42,8 89.66,7.24 87.12,7.24 84.84,9.53 82.8,9.53 82.3,10.03 82.3,19.68 78.23,23.75 78.23,24.51 78.99,25.27 v80.26,25.27
  Bottom 0.254: v80.26,25.27 80.26,36.45 78.21,38.5 IC2.16
N$52  (via drill 0.5)
  Top 0.254: v81.28,26.29 81.28,24.76 85.09,20.95 85.09,13.34 85.72,12.7 X2.3
  Bottom 0.254: v81.28,26.29 81.28,36.45 78.58,39.15 IC2.15
N$53
  Bottom 0.254: IC2.1 71.53,30.7 73.03,29.21 73.03,26.88 L4.2
  Bottom 0.305: 69.44,30.7 IC2.1
N$54
  Bottom 0.254: IC2.5 72.49,33.3 75.56,30.23 75.56,28.16 L3.2
N$63
  Bottom 0.254: IC2.12 68.97,37.85 68.58,37.47 68.58,28.79 L2.1
N$64  (via drill 0.5)
  other vias: 72.39,31.37
N$65  (via drill 0.5)
  other vias: 74.93,38.48
N$66
  Top 0.406: Q1.2 15.07,29.83 R2.2
N$70  (via drill 0.5)
  other vias: 69.85,7.24
N$71
  Top 0.406: C18.2 36.73,3.96 Q3.1
  Bottom 0.254: R6.2 43.01,3.96 Q3.1
N$72  (via drill 0.5)
  other vias: 68.58,6.22
N$75  (via drill 0.5)
  other vias: 79.25,24.26
N$78
  Top 0.406: C17.2 36.98,6.46 Q3.2
  Bottom 0.254: IC3.6 40.1,6.46 Q3.2
N$80  (via drill 0.5)
  other vias: 80.26,25.27
N$81  (via drill 0.5)
  other vias: 81.28,26.29
N$85  (via drill 0.5)
  other vias: 80.52,41.27
N$86  (via drill 0.5)
  other vias: 83.31,30.86
N$91  (via drill 0.5)
  other vias: 83.82,33.4
N$92  (via drill 0.5)
  other vias: 84.84,37.47
N$93  (via drill 0.5)
  other vias: 85.85,35.94
N$94  (via drill 0.5)
  other vias: 79.25,40.26
N$95  (via drill 0.5)
  other vias: 77.72,41.27
N$96  (via drill 0.5)
  other vias: 15.75,49.15
N$97
  Top 0.406: R4.2 18.44,55.91 IC11.LP5
N$120
  Top 0.406: LED1.C 56.9,58.29 56.03,57.43 R16.2
N$136
  Top 0.406: R15.2 52.22,50.47 Q7.2
N$163
  Bottom 0.406: IC8.1 61.09,33.53 63.25,35.69 63.25,42.04 71.63,50.42 87.88,50.42 90.68,47.62 LSP3.MP
N$165
  Bottom 0.406: IC8.3 58.56,33.28 60.2,34.93 61.21,34.93 62.48,36.2 62.48,42.55 71.12,51.18 92.24,51.18 OUTR.MP
N$172
  Bottom 0.406: IC8.14 58.55,39.12 57.66,40.01 51.31,40.01 40.89,50.42 8.38,50.42 5.59,47.62 LSP2.MP
N$178
  Bottom 0.406: IC8.7 53.48,30.74 52.32,29.59 48.26,29.59 R11.2
N$180
  Bottom 0.406: IC8.10 53.47,38.86 53.09,39.24 50.8,39.24 49.78,40.26 48.26,40.26 R12.2
NRST  (via drill 0.5)
  Top 0.254: C12.2 | SV1.10 64.77,7.49 68.07,4.19 v72.9,4.19
  Top 0.406: C12.2 62.11,11.43 SV1.10 | v60.96,14.86 C12.2
  Bottom 0.254: IC3.7 46.78,13.84 51.56,13.84 54.1,16.38 59.44,16.38 v60.96,14.86 | v72.9,4.19 82.55,4.19 J1.P$2
PC0
  Bottom 0.254: IC3.8 41.25,9.02 24.89,9.02 12.45,21.46 12.45,24.26 10.16,26.54 5.33,26.54 3.3,28.57 SV2.4
PC13
  Bottom 0.254: IC3.2 45.72,9.25 45.72,8.76 46.23,8.26 48.01,8.26 49.02,7.24 49.02,3.17 48.01,2.16 30.99,2.16 11.94,21.21 11.94,24 9.91,26.04 SV2.3
PIEZO
  Bottom 0.254: IC3.10 40.85,10.03 25.4,10.03 18.29,17.14 18.29,36.07 SG1.+
Q2M  (via drill 0.5)
  Top 0.406: v47.75,6.99 50.33,6.99 arc-90 Q5.1 arc-90 50.69,6.98 C24.2
  Bottom 0.254: IC3.3 45.21,9.45 45.21,7.75 46.23,6.99 v47.75,6.99
Q2P  (via drill 0.5)
  Top 0.406: v47.75,3.43 50.34,3.43 | 50.34,3.43 arc90 Q5.4 | C25.2 53.71,3.43 50.34,3.43
  Bottom 0.254: IC3.4 44.7,9.64 44.7,4.19 45.72,3.43 v47.75,3.43
SD-CK  (via drill 0.5)
  Top 0.254: L7.1 83.82,38.48 v84.84,37.47
  Bottom 0.254: IC3.53 58.35,8.76 75.95,8.76 77.47,10.29 77.47,18.41 84.84,25.78 v84.84,37.47
SD-CMD  (via drill 0.5)
  Top 0.254: v85.85,35.94 L8.1
  Bottom 0.254: IC3.54 58.16,8.26 76.2,8.26 77.98,10.03 77.98,18.16 85.34,25.53 85.34,35.43 v85.85,35.94
SD-D0
  Bottom 0.254: IC3.39 54.06,23.24 60.45,23.24 62.4,25.18 L6.1
SD-D1
  Bottom 0.254: IC3.40 54.26,22.73 60.71,22.73 61.98,24 67.31,24 67.94,24.64 L5.1
SD-D2  (via drill 0.5)
  Top 0.254: v83.31,30.86 L10.1
  Bottom 0.254: IC3.51 58.75,9.78 75.44,9.78 76.45,10.79 76.45,18.92 83.31,25.78 v83.31,30.86
SD-D3  (via drill 0.5)
  Top 0.254: v83.82,33.4 L9.1
  Bottom 0.254: IC3.52 58.55,9.27 75.69,9.27 76.96,10.54 76.96,18.67 84.33,26.04 84.33,32.89 v83.82,33.4
SD-DET  (via drill 0.5)
  Top 0.254: 80,43.31 X3.DETECT2 79.81,41.98 v80.52,41.27
  Bottom 0.254: IC3.45 55,19.94 60.71,19.94 63.75,16.89 73.66,16.89 82.3,25.53 82.3,39.5 v80.52,41.27
SD-ON  (via drill 0.5)
  Top 0.254: 49.43,55.4 R14.2
  Top 0.406: R14.2 51.27,53.66 Q7.1 | v62.23,22.73 62.23,40.77 v60.71,42.29 | v49.02,45.34 47.75,46.61 47.75,53.72 49.43,55.4
  Bottom 0.254: IC3.43 55.36,21.72 61.21,21.72 v62.23,22.73 | v49.02,45.34 52.07,42.29 v60.71,42.29
SD-VDD
  Top 0.406: Q8.3 63.37,52.71 arc90 C29.2 | LED1.A 64.3,56.3 63.5,55.5 C29.2 | C29.2 67.18,52.84 74.42,45.59 X3.VDD
TCK
  Bottom 0.254: IC3.49 56.61,13.34 61.72,13.34 64.01,15.62 70.36,15.62 71.12,14.86 71.12,12.7 SV1.4
TDI
  Bottom 0.254: IC3.50 56.53,12.71 66.03,12.71 SV1.8
TDO  (via drill 0.5)
  Top 0.254: v69.85,7.24 SV1.6
  Bottom 0.254: IC3.55 58.47,7.24 v69.85,7.24
TEMP-OUT
  Bottom 0.254: IC3.15 40.62,13.34 31.24,13.34 27.69,16.89 IC10.OUT
TMS
  Bottom 0.254: IC3.46 55.2,19.43 60.45,19.43 63.5,16.38 72.64,16.38 73.66,15.37 73.66,12.7 SV1.2
TRST  (via drill 0.5)
  Top 0.254: v68.58,6.22 68.58,12.7 SV1.7
  Bottom 0.254: IC3.56 58.77,6.22 v68.58,6.22
USB-BUS4  (via drill 0.5)
  Top 0.254: v75.69,20.7 78.99,17.4 v78.99,17.14
  Bottom 0.254: IC3.57 59.08,5.21 69.85,5.21 72.39,7.75 76.45,7.75 78.99,10.29 v78.99,17.14 | L2.2 70.48,23.75 70.99,23.24 73.15,23.24 v75.69,20.7
USB-RX  (via drill 0.5, 0.5 pad 0.5)
  Top 0.254: v76.71,21.72 79.25,19.18 79.25,18.41 v81.28,16.38
  Bottom 0.254: IC3.59 58.68,4.19 70.36,4.19 72.9,6.73 76.96,6.73 81.28,11.05 v81.28,16.38 | v76.71,21.72 73.24,25.18 L4.1
USB-TX  (via drill 0.5)
  Top 0.254: v77.72,22.73 80.26,20.19 v80.26,18.92
  Bottom 0.254: IC3.58 58.88,4.7 70.1,4.7 72.64,7.24 76.71,7.24 80.26,10.79 v80.26,18.92 | L3.1 75.27,25.18 v77.72,22.73
VCAP1  (via drill 0.5)
  Top 0.406: C8.2 52.07,21.97 v50.29,20.19
  Bottom 0.254: v50.29,20.19 49.05,20.19 IC3.31
VCAP2  (via drill 0.5)
  Top 0.406: v50.29,14.86 51.05,14.1 C9.2
  Bottom 0.254: IC3.47 51.33,14.86 v50.29,14.86
VCC  (via drill 0.5)
  Top 0.406: 48.26,13.08 C5.2 48.26,12.95 v48.26,11.3 | 43.69,16.38 42.8,16.38 | v44.2,15.11 43.69,14.86 42.93,14.35 C6.2 | C3.2 v44.2,17.65 | 42.8,16.38 42.67,16.38 | 48.26,20.45 C2.2 arc-90 48.26,20.58 | 53.72,16.38 53.59,16.38 | 54.99,16.5 55.12,16.38 | C4.2 v56.64,18.41 | Q8.2 58.57,50.47 R17.2 | 64.14,16.5 64.26,16.38 | 17.83,19.68 10.16,19.68 OPH1.2 | IC10.VDD 33.15,21.84 C30.2
  Top 0.813: IC1.2 17.83,19.68 19.56,19.68 22.86,16.38 C11.2 C7.2 37.08,16.38 | 37.08,16.38 42.67,16.38 43.69,16.38 48.26,16.38 | 48.26,16.38 53.59,16.38 55.12,16.38 64.26,16.38 74.17,16.38 74.93,15.62 SV1.1 | 42.8,16.38 C6.2 | C3.2 42.8,16.38 | 48.26,16.38 48.26,20.45 | 48.26,20.58 v48.26,22.22 | C4.2 54.99,16.5 | 48.26,16.38 48.26,13.08 | C30.2 37.08,16.38 | SV3.10 92.46,43.82 89.15,47.12 v89.15,52.71 | R17.2 58.67,48.79 60.6,48.79 v60.71,48.9 | v58.93,26.29 60.45,27.81 60.45,37.97 58.67,39.75 v58.67,43.82 | IC11.LP2 12.07,55.88 C31.2
  Bottom 0.254: IC3.1 48.26,11.08 | 48.26,11.08 v48.26,11.3 48.26,11.08 | IC3.64 48.26,11.08 | IC3.19 43.1,17.65 v44.2,17.65 | IC3.32 47.72,22.22 v48.26,22.22 | IC3.48 55.59,18.41 v56.64,18.41 | v44.2,15.11 43.81,15.11 IC3.13
  Bottom 0.813: v58.93,26.29 50.29,26.29 48.26,24.26 v48.26,22.22 | IC11.LP2 11.43,54.48 13.21,52.71 60.96,52.71 | 60.96,52.71 v89.15,52.71 | 60.96,52.71 60.71,52.45 v60.71,48.9 60.71,45.85 v58.67,43.82
VIN  (via drill 0.6)
  Top 0.406: 17.32,42.56 R10.2
  Top 0.813: C10.+ 14.1,12.06 14.1,12.57 | 14.1,12.57 C1.2 14.33,17.37 IC1.3 | Q6.2 17.32,42.56 | X1.2 13.97,12.7 14.1,12.57 | R5.2 10.01,28.27 Q2.2 | R5.2 10.01,32.49 10.92,33.4 13.46,33.4 14.48,34.42 14.48,39.24 15.49,40.26 16.51,40.26 17.27,41.02 17.27,42.52 R10.2 | R5.2 8.38,31.11 5.59,28.32 v5.59,22.73
  Bottom 0.813: X1.2 8.58,12.83 6.35,12.83 5.59,13.59 v5.59,22.73 v5.59,24.26
VREF  (via drill 0.5)
  Top 0.406: R9.1 43.94,55.4 IC4.2 IC4.1 44.41,51.98 C20.2 C19.2 41.79,50.3 40.64,49.15 v40.64,43.31
  Bottom 0.305: IC5.3 41.53,30.48 42.67,31.62 42.67,38.23 | IC6.3 42.55,38.1 arc90 42.67,38.23 | 42.67,38.23 42.67,42.55 41.91,43.31 v40.64,43.31

### Text on the board
tNames: GND | VEXT | B1 | B3 | VR | S7 | D0 | DC | LS | LR | C0 | CK | C13 | MO | B2 | B4 | VIN | GEXT